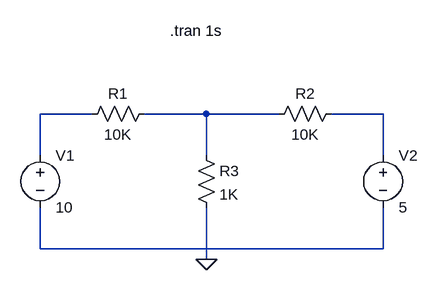
[diagram p0: schematic Pre-Lab 4 Part 1.asc]
Pre-Lab 4 Part 1.asc, the LTspice schematic file:
Version 4
SHEET 1 880 680
WIRE 336 112 256 112
WIRE 512 112 416 112
WIRE 624 112 512 112
WIRE 784 112 704 112
WIRE 256 176 256 112
WIRE 512 176 512 112
WIRE 784 176 784 112
WIRE 256 320 256 256
WIRE 784 320 784 256
WIRE 784 320 256 320
WIRE 512 336 512 256
FLAG 512 336 0
SYMBOL voltage 256 160 R0
SYMATTR InstName V1
SYMATTR Value 10
SYMBOL voltage 784 160 R0
SYMATTR InstName V2
SYMATTR Value 5
SYMBOL res 320 128 R270
WINDOW 0 32 56 VTop 2
WINDOW 3 0 56 VBottom 2
SYMATTR InstName R1
SYMATTR Value 10K
SYMBOL res 608 128 R270
WINDOW 0 32 56 VTop 2
WINDOW 3 0 56 VBottom 2
SYMATTR InstName R2
SYMATTR Value 10K
SYMBOL res 496 160 R0
SYMATTR InstName R3
SYMATTR Value 1K
TEXT 456 -16 Left 2 !.tran 1s

The netlist it stands for:
* Pre-Lab 4 Part 1.asc
V1 N001 N004 10
V2 N003 N004 5
R1 N001 N002 10K
R2 N002 N003 10K
R3 N002 0 1K
.tran 1s
.backanno
.end